# EAGLE design MUXCLOCK (1) (EAGLE 9.6.2)
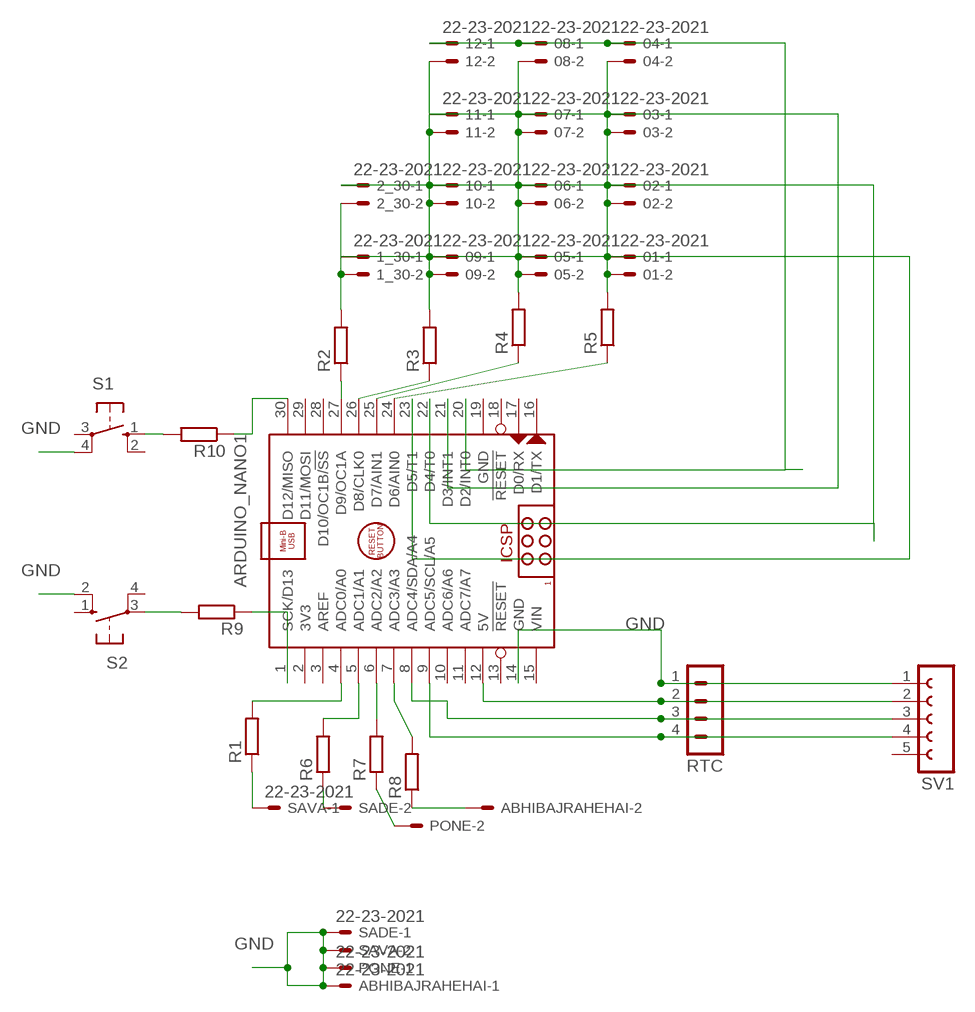
[diagram p0: schematic, sheet 1]

## Parts
01  22-23-2021  [22-23-2021]
1_30  22-23-2021  [22-23-2021]
02  22-23-2021  [22-23-2021]
2_30  22-23-2021  [22-23-2021]
03  22-23-2021  [22-23-2021]
04  22-23-2021  [22-23-2021]
05  22-23-2021  [22-23-2021]
06  22-23-2021  [22-23-2021]
07  22-23-2021  [22-23-2021]
08  22-23-2021  [22-23-2021]
09  22-23-2021  [22-23-2021]
10  22-23-2021  [22-23-2021]
11  22-23-2021  [22-23-2021]
12  22-23-2021  [22-23-2021]
ABHIBAJRAHEHAI  22-23-2021  [22-23-2021]
ARDUINO_NANO1  ARDUINO_NANO  [ARDUINO_NANO]
PONE  22-23-2021  [22-23-2021]
R1  R-EU_0204/7  [0204/7]
R2  R-EU_0204/7  [0204/7]
R3  R-EU_0204/7  [0204/7]
R4  R-EU_0204/7  [0204/7]
R5  R-EU_0204/7  [0204/7]
R6  R-EU_0204/7  [0204/7]
R7  R-EU_0204/7  [0204/7]
R8  R-EU_0204/7  [0204/7]
R9  R-EU_0204/7  [0204/7]
R10  R-EU_0204/7  [0204/7]
RTC  MA04-1  [MA04-1]
S1  10-XX  [B3F-10XX]
S2  10-XX  [B3F-10XX]
SADE  22-23-2021  [22-23-2021]
SAVA  22-23-2021  [22-23-2021]
SV1  FE05W  [FE05W]

## Nets
GND: ABHIBAJRAHEHAI.1 ARDUINO_NANO1.14(GND) PONE.1 RTC.1 S1.4(P1) S2.2(S1) SADE.1 SAVA.2 SV1.1
N$1: ARDUINO_NANO1.27(D9/OC1A) R2.1
N$2: ARDUINO_NANO1.26(D8/CLK0) R3.1
N$3: ARDUINO_NANO1.25(D7/AIN1) R4.1
N$4: ARDUINO_NANO1.24(D6/AIN0) R5.1
N$5: 01.1 1_30.1 05.1 09.1 ARDUINO_NANO1.23(D5/T1)
N$6: 02.1 2_30.1 06.1 10.1 ARDUINO_NANO1.22(D4/T0)
N$7: 03.1 07.1 11.1 ARDUINO_NANO1.21(D3/INT1)
N$8: 04.1 08.1 12.1 ARDUINO_NANO1.20(D2/INT0)
N$9: 01.2 02.2 03.2 04.2 R5.2
N$10: 05.2 06.2 07.2 08.2 R4.2
N$11: 09.2 10.2 11.2 12.2 R3.2
N$12: 1_30.2 2_30.2 R2.2
N$13: ARDUINO_NANO1.4(ADC0/A0) R1.2
N$14: ARDUINO_NANO1.5(ADC1/A1) R6.2
N$15: ARDUINO_NANO1.6(ADC2/A2) R7.2
N$16: ARDUINO_NANO1.7(ADC3/A3) R8.2
N$17: R1.1 SAVA.1
N$18: R6.1 SADE.2
N$19: PONE.2 R7.1
N$20: ABHIBAJRAHEHAI.2 R8.1
N$21: ARDUINO_NANO1.1(SCK/D13) R9.1
N$22: R9.2 S2.3(P)
N$23: ARDUINO_NANO1.30(D12/MISO) R10.1
N$24: R10.2 S1.1(S)
N$26: ARDUINO_NANO1.12(5V) RTC.2 SV1.2
N$27: ARDUINO_NANO1.8(ADC4/SDA/A4) RTC.3 SV1.3
N$28: ARDUINO_NANO1.9(ADC5/SCL/A5) RTC.4 SV1.4
Unconnected: ARDUINO_NANO1.2(3V3) ARDUINO_NANO1.3(AREF) ARDUINO_NANO1.10(ADC6/A6) ARDUINO_NANO1.11(ADC7/A7) ARDUINO_NANO1.13(!RESET) ARDUINO_NANO1.16(D1/TX) ARDUINO_NANO1.17(D0/RX) ARDUINO_NANO1.18(!RESET) ARDUINO_NANO1.28(D10/OC1B/!SS) ARDUINO_NANO1.29(D11/MOSI) S1.2(S1) S1.3(P) S2.1(S) S2.4(P1) SV1.5

## Power pins joined to a net without a drawn wire
GND: ARDUINO_NANO1.19(GND)
VIN: ARDUINO_NANO1.15(VIN)

## Library data of the parts
01 1_30 02 2_30 03-09 10-12 ABHIBAJRAHEHAI PONE SADE SAVA = con-molex:22-23-2021: .100" (2.54mm) Center Header - 2 Pin; MF: MOLEX; MPN: 22-23-2021; OC_FARNELL: 1462926; OC_NEWARK: 25C3832
ARDUINO_NANO1 = ArduinoNanoV30:ARDUINO_NANO: Arduino Nano V3.0 Module Overview: The Arduino Nano is a small, complete, and breadboard-friendly board based on the ATmega328 (Arduino Nano 3.x) or ATmega168 (Arduino Nano 2.x). It has more or less the same functionality of the Arduino Duemilanove, but in a different package. It lacks only a DC power jack, and works with a Mini-B USB cable instead of a standard one. The Nano was designed and is being produced by Gravitech <http://www.gravitech.us/arna30wiatp.html>. General specifications: Item Value Microcontroller Atmel ATmega168 or ATmega328 Operating Voltage (logic level) 5 V Input Voltage (recommended) 7-12 V Input Voltage (limits) 6-20 V Digital I/O Pins 14 (of which 6 provide PWM output) Analog Input Pins 8 DC Current per I/O Pin 40 mA Flash Memory 16 KB (ATmega168) or 32 KB (ATmega328) of which 2 KB used by bootloader SRAM 1 KB (ATmega168) or 2 KB (ATmega328) EEPROM 512 bytes (ATmega168) or 1 KB (ATmega328) Clock Speed 16 MHz Dimensions (Inches) 0.73" x 1.70" Dimensions (mm) 18mm x 45mm Overall height About 9 mm (not including pins) Weigth 5 g Power: The Arduino Nano can be powered via the Mini-B USB connection, 6-20V unregulated external power supply (pin 30), or 5V regulated external power supply (pin 27). The power source is automatically selected to the highest voltage source. Memory: The ATmega168 has 16 KB of flash memory for storing code (of which 2 KB is used for the bootloader); the ATmega328 has 32 KB, (also with 2 KB used for the bootloader). The ATmega168 has 1 KB of SRAM and 512 bytes of EEPROM (which can be read and written with the EEPROM library); the ATmega328 has 2 KB of SRAM and 1 KB of EEPROM. Input and Output: Each of the 14 digital pins on the Nano can be used as an input or output, using pinMode(), digitalWrite(), and digitalRead() functions. They operate at 5 volts. Each pin can provide or receive a maximum of 40 mA and has an internal pull-up resistor (disconnected by default) of 20-50 kOhms. In addition, some pins have specialized functions. Visit Arduino - ArduinoBoardNano <https://www.arduino.cc/en/Main/ArduinoBoardNano>
R1-R10 = resistor:R-EU_: RESISTOR, European symbol
RTC = con-lstb:MA04-1: PIN HEADER; OC_FARNELL: unknown; OC_NEWARK: unknown
S1 S2 = switch-omron:10-XX: OMRON SWITCH; MPN: B3F-1000; OC_FARNELL: 176432; OC_NEWARK: 36M3542
SV1 = con-lsta:FE05W: FEMALE HEADER; OC_FARNELL: unknown; OC_NEWARK: unknown

## Board
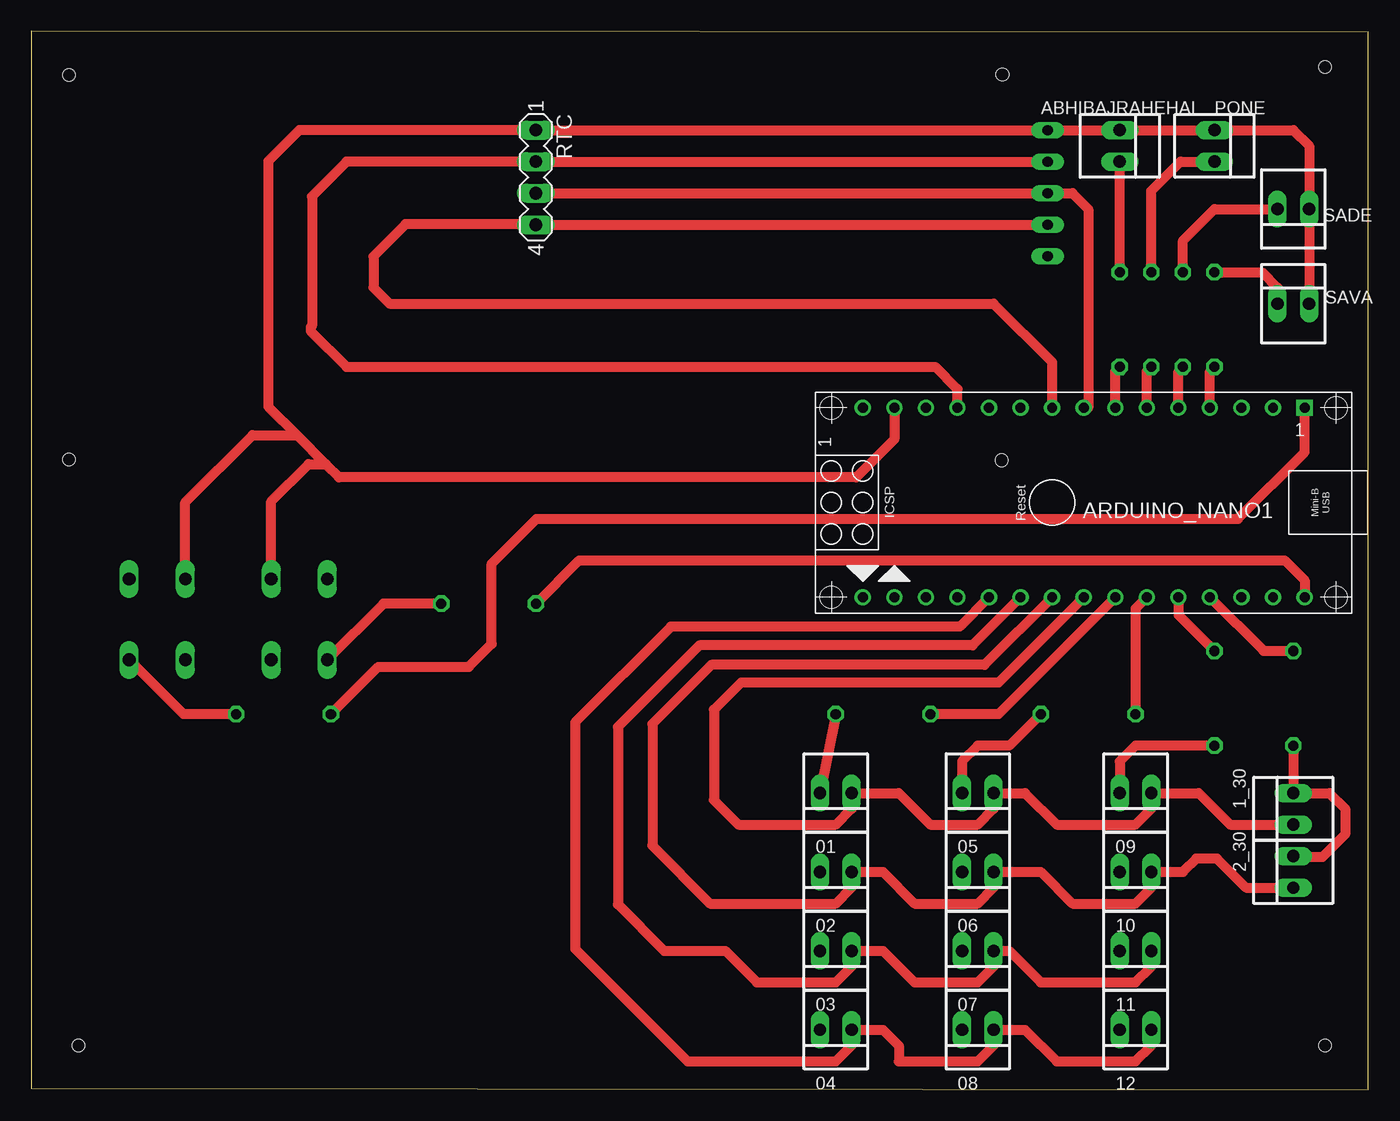
[diagram p1: board, top side]
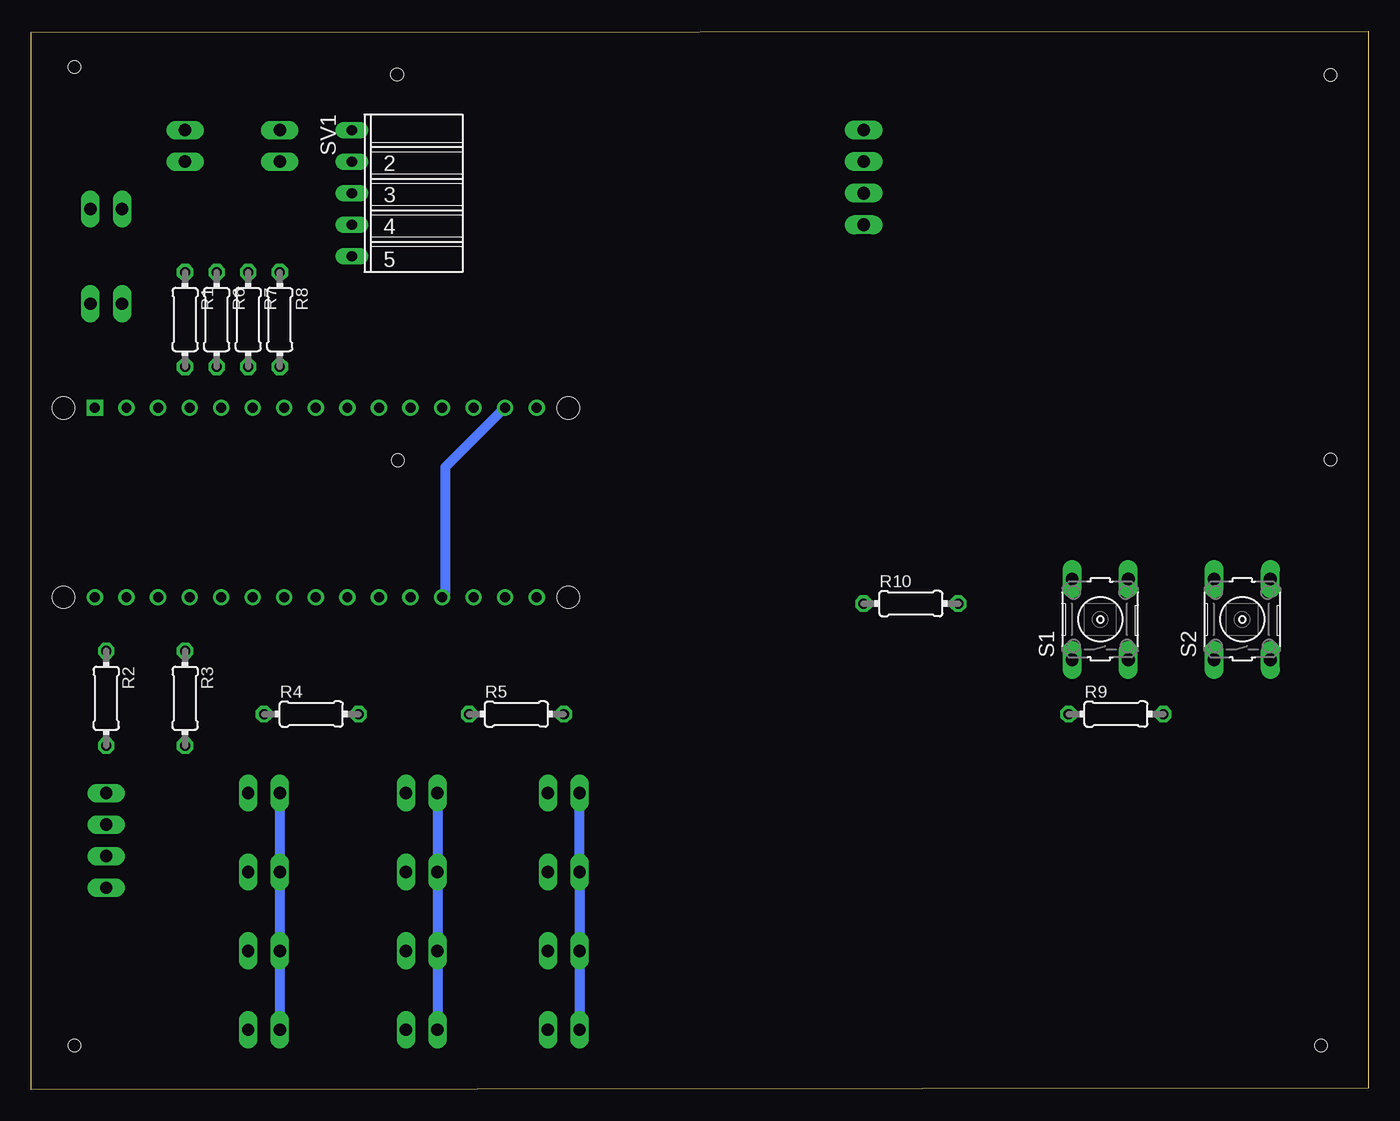
[diagram p2: board, bottom side, seen from below]

Size 107.65 x 85.18 mm. Coordinates in mm from the lower left corner, seen from the top.
Outline: 0,0.1 107.65,0 107.65,85.08 0,85.18 0,0.1
Copper layers (1*16): Top 0.035mm / dielectric 1.5mm / Bottom 0.035mm
Design rules "default *": minimum track width 32mil, minimum drill 0.35mm, track to track 12mil, track to pad 12mil, pad to pad 12mil, via to via 12mil, smd to smd 12mil, copper to edge 40mil, drill to drill 20mil, minimum pad ring 10mil, minimum via ring 8mil, stop-mask expansion 4mil, vias tented up to drill 0mil, thermal gap 10mil
Holes 1 mm at 3.81,3.55 104.14,3.55 104.14,82.29 3.06,81.63 3.06,50.71 78.12,50.64 78.19,81.69

### Footprints (pad centres in the part's own frame; a part is rotated, then mirrored left to right if it is on the bottom)
22-23-2021 = drill 1 long: 1 -1.27,0; 2 1.27,0
ARDUINO_NANO = drill 0.8 square: 1 -20.32,-7.62 | drill 0.8: 2 -17.78,-7.62; 3 -15.24,-7.62; 4 -12.7,-7.62; 5 -10.16,-7.62; 6 -7.62,-7.62; 7 -5.08,-7.62; 8 -2.54,-7.62; 9 0,-7.62; 10 2.54,-7.62; 11 5.08,-7.62; 12 7.62,-7.62; 13 10.16,-7.62; 14 12.7,-7.62; 15 15.24,-7.62; 16 15.24,7.62; 17 12.7,7.62; 18 10.16,7.62; 19 7.62,7.62; 20 5.08,7.62; 21 2.54,7.62; 22 0,7.62; 23 -2.54,7.62; 24 -5.08,7.62; 25 -7.62,7.62; 26 -10.16,7.62; 27 -12.7,7.62; 28 -15.24,7.62; 29 -17.78,7.62; 30 -20.32,7.62 | hole 1.778: -22.86,-7.62; -22.86,7.62; 17.78,7.62; 17.78,-7.62
0204/7 = drill 0.813 octagon: 1 -3.81,0; 2 3.81,0
MA04-1 = drill 1.016 long: 1 -3.81,0; 2 -1.27,0; 3 1.27,0; 4 3.81,0
B3F-10XX = drill 1.016 long: 1 -3.251,2.261; 2 3.251,2.261; 3 -3.251,-2.261; 4 3.251,-2.261
FE05W = drill 0.813 long: 1 -5.08,0; 2 -2.54,0; 3 0,0; 4 2.54,0; 5 5.08,0

### Placement (x,y rotation side)
01  64.77,23.87 180 top
1_30  101.6,22.6 90 top
02  64.77,17.52 180 top
2_30  101.6,17.52 90 top
03  64.77,11.17 180 top
04  64.77,4.82 180 top
05  76.2,23.87 180 top
06  76.2,17.52 180 top
07  76.2,11.17 180 top
08  76.2,4.82 180 top
09  88.9,23.87 180 top
10  88.9,17.52 180 top
11  88.9,11.17 180 top
12  88.9,4.82 180 top
ABHIBAJRAHEHAI  87.63,75.94 270 top
ARDUINO_NANO1  82.19,47.24 180 top
PONE  95.25,75.94 270 top
R1  95.25,61.97 270 bottom
R2  101.6,31.49 270 bottom
R3  95.25,31.49 270 bottom
R4  85.09,30.22 0 bottom
R5  68.58,30.22 0 bottom
R6  92.71,61.97 270 bottom
R7  90.17,61.97 270 bottom
R8  87.63,61.97 270 bottom
R9  20.32,30.22 0 bottom
R10  36.83,39.11 0 bottom
RTC  40.64,73.4 270 top
S1  21.59,37.84 90 bottom
S2  10.16,37.84 90 bottom
SADE  101.6,70.86 180 top
SAVA  101.6,63.24 0 top
SV1  81.82,72.13 270 bottom

### Tracks (layer width: path | path; a pad name or v marks a point on that pad's centre or on a via)
GND
  Top 0.813: ARDUINO_NANO1.14 69.49,52.32 66.44,49.27 24.79,49.27 23.73,50.33 | SAVA.2 SADE.1 102.87,75.94 101.6,77.21 PONE.1 ABHIBAJRAHEHAI.1 SV1.1 RTC.1 21.59,77.21 19.1,74.71 19.1,54.96 21.4,52.65 | 21.4,52.65 23.73,50.33 | S1.4 19.33,47.33 22.32,50.33 23.73,50.33 | S2.2 12.42,47.24 17.83,52.65 21.4,52.65
  Bottom 0.813: ARDUINO_NANO1.19 74.32,40.02 74.32,50.08 69.85,54.55 ARDUINO_NANO1.14
N$1
  Top 0.813: ARDUINO_NANO1.27 99.21,35.3 R2.1
N$2
  Top 0.813: ARDUINO_NANO1.26 92.35,38.2 R3.1
N$3
  Top 0.813: ARDUINO_NANO1.25 88.9,38.71 R4.1
N$4
  Top 0.813: ARDUINO_NANO1.24 77.86,30.22 R5.1
N$5
  Top 0.813: ARDUINO_NANO1.23 77.86,32.76 57.15,32.76 54.97,30.58 54.97,23.3 56.94,21.33 64.77,21.33 66.04,22.6 01.1 69.85,23.87 72.39,21.33 76.2,21.33 77.47,22.6 05.1 80.01,23.87 82.55,21.33 88.9,21.33 90.17,22.6 09.1 93.98,23.87 96.52,21.33 1_30.1
N$6
  Top 0.813: ARDUINO_NANO1.22 76.75,34.18 54.76,34.18 50.01,29.43 50.01,19.63 54.66,14.98 64.77,14.98 66.04,16.25 02.1 68.58,17.52 71.12,14.98 76.2,14.98 77.47,16.25 06.1 81.28,17.52 83.82,14.98 88.9,14.98 90.17,16.25 10.1 92.71,17.52 93.78,18.59 95.44,18.59 97.79,16.25 2_30.1
N$7
  Top 0.813: ARDUINO_NANO1.21 75.78,35.75 53.79,35.75 47.23,29.19 47.23,14.9 50.97,11.17 55.88,11.17 58.42,8.63 64.77,8.63 66.04,9.9 03.1 68.58,11.17 71.12,8.63 76.2,8.63 77.47,9.9 07.1 78.74,11.17 81.28,8.63 88.9,8.63 90.17,9.9 11.1
N$8
  Top 0.813: ARDUINO_NANO1.20 74.75,37.26 51.49,37.26 43.79,29.56 43.79,11.33 52.84,2.28 64.77,2.28 66.04,3.55 04.1 68.58,4.82 69.85,3.55 69.85,2.28 76.2,2.28 77.47,3.55 08.1 80.01,4.82 82.55,2.28 88.9,2.28 90.17,3.55 12.1
N$9
  Top 0.813: R5.2 01.2
  Bottom 0.813: 01.2 63.5,23.11 63.5,18.27 02.2 63.5,16.76 63.5,11.92 03.2 63.5,10.41 63.5,5.57 04.2
N$10
  Top 0.813: R4.2 78.74,27.68 76.2,27.68 74.93,26.41 05.2
  Bottom 0.813: 05.2 74.93,23.11 74.93,18.27 06.2 74.93,16.76 74.93,11.92 07.2 74.93,10.41 74.93,5.57 08.2
N$11
  Top 0.813: 09.2 87.63,26.41 88.9,27.68 R3.2
  Bottom 0.813: 09.2 87.63,23.11 87.63,18.27 10.2 87.63,16.76 87.63,11.92 11.2 87.63,10.41 87.63,5.57 12.2
N$12
  Top 0.813: R2.2 1_30.2 104.51,23.87 105.76,22.62 105.76,20.53 103.95,18.72 101.67,18.72 2_30.2
N$13
  Top 0.813: ARDUINO_NANO1.4 94.89,57.8 R1.2
N$14
  Top 0.813: ARDUINO_NANO1.5 92.35,57.8 R6.2
N$15
  Top 0.813: ARDUINO_NANO1.6 89.81,57.8 R7.2
N$16
  Top 0.813: ARDUINO_NANO1.7 87.27,57.8 R8.2
N$17
  Top 0.813: R1.1 95.3,65.73 99.15,65.73 100.33,64.54 SAVA.1
N$18
  Top 0.813: R6.1 92.71,68.32 95.25,70.86 SADE.2
N$19
  Top 0.813: R7.1 90.17,72.32 92.52,74.67 PONE.2
N$20
  Top 0.813: R8.1 ABHIBAJRAHEHAI.2
N$21
  Top 0.813: R9.1 27.94,34.03 35.23,34.03 37.08,35.88 37.08,42.32 40.68,45.92 97.14,45.92 102.51,51.29 ARDUINO_NANO1.1
N$22
  Top 0.813: R9.2 12.27,30.22 S2.3
N$23
  Top 0.813: R10.1 44.11,42.58 100.91,42.58 102.51,40.98 ARDUINO_NANO1.30
N$24
  Top 0.813: S1.1 28.37,39.11 R10.2
N$26
  Top 0.813: SV1.2 RTC.2 25.4,74.67 22.61,71.88 22.61,61.45 22.52,61.36 22.52,61.04 25.4,58.16 72.78,58.16 74.57,56.37 ARDUINO_NANO1.12
N$27
  Top 0.813: RTC.3 SV1.3 83.82,72.13 85.09,70.86 85.09,54.86 ARDUINO_NANO1.8
N$28
  Top 0.813: SV1.4 RTC.4 40.59,69.64 30.15,69.64 27.56,67.06 27.56,64.53 28.86,63.24 77.47,63.24 82.19,58.52 ARDUINO_NANO1.9